# EAGLE design gs_box_board (EAGLE 9.6.2)
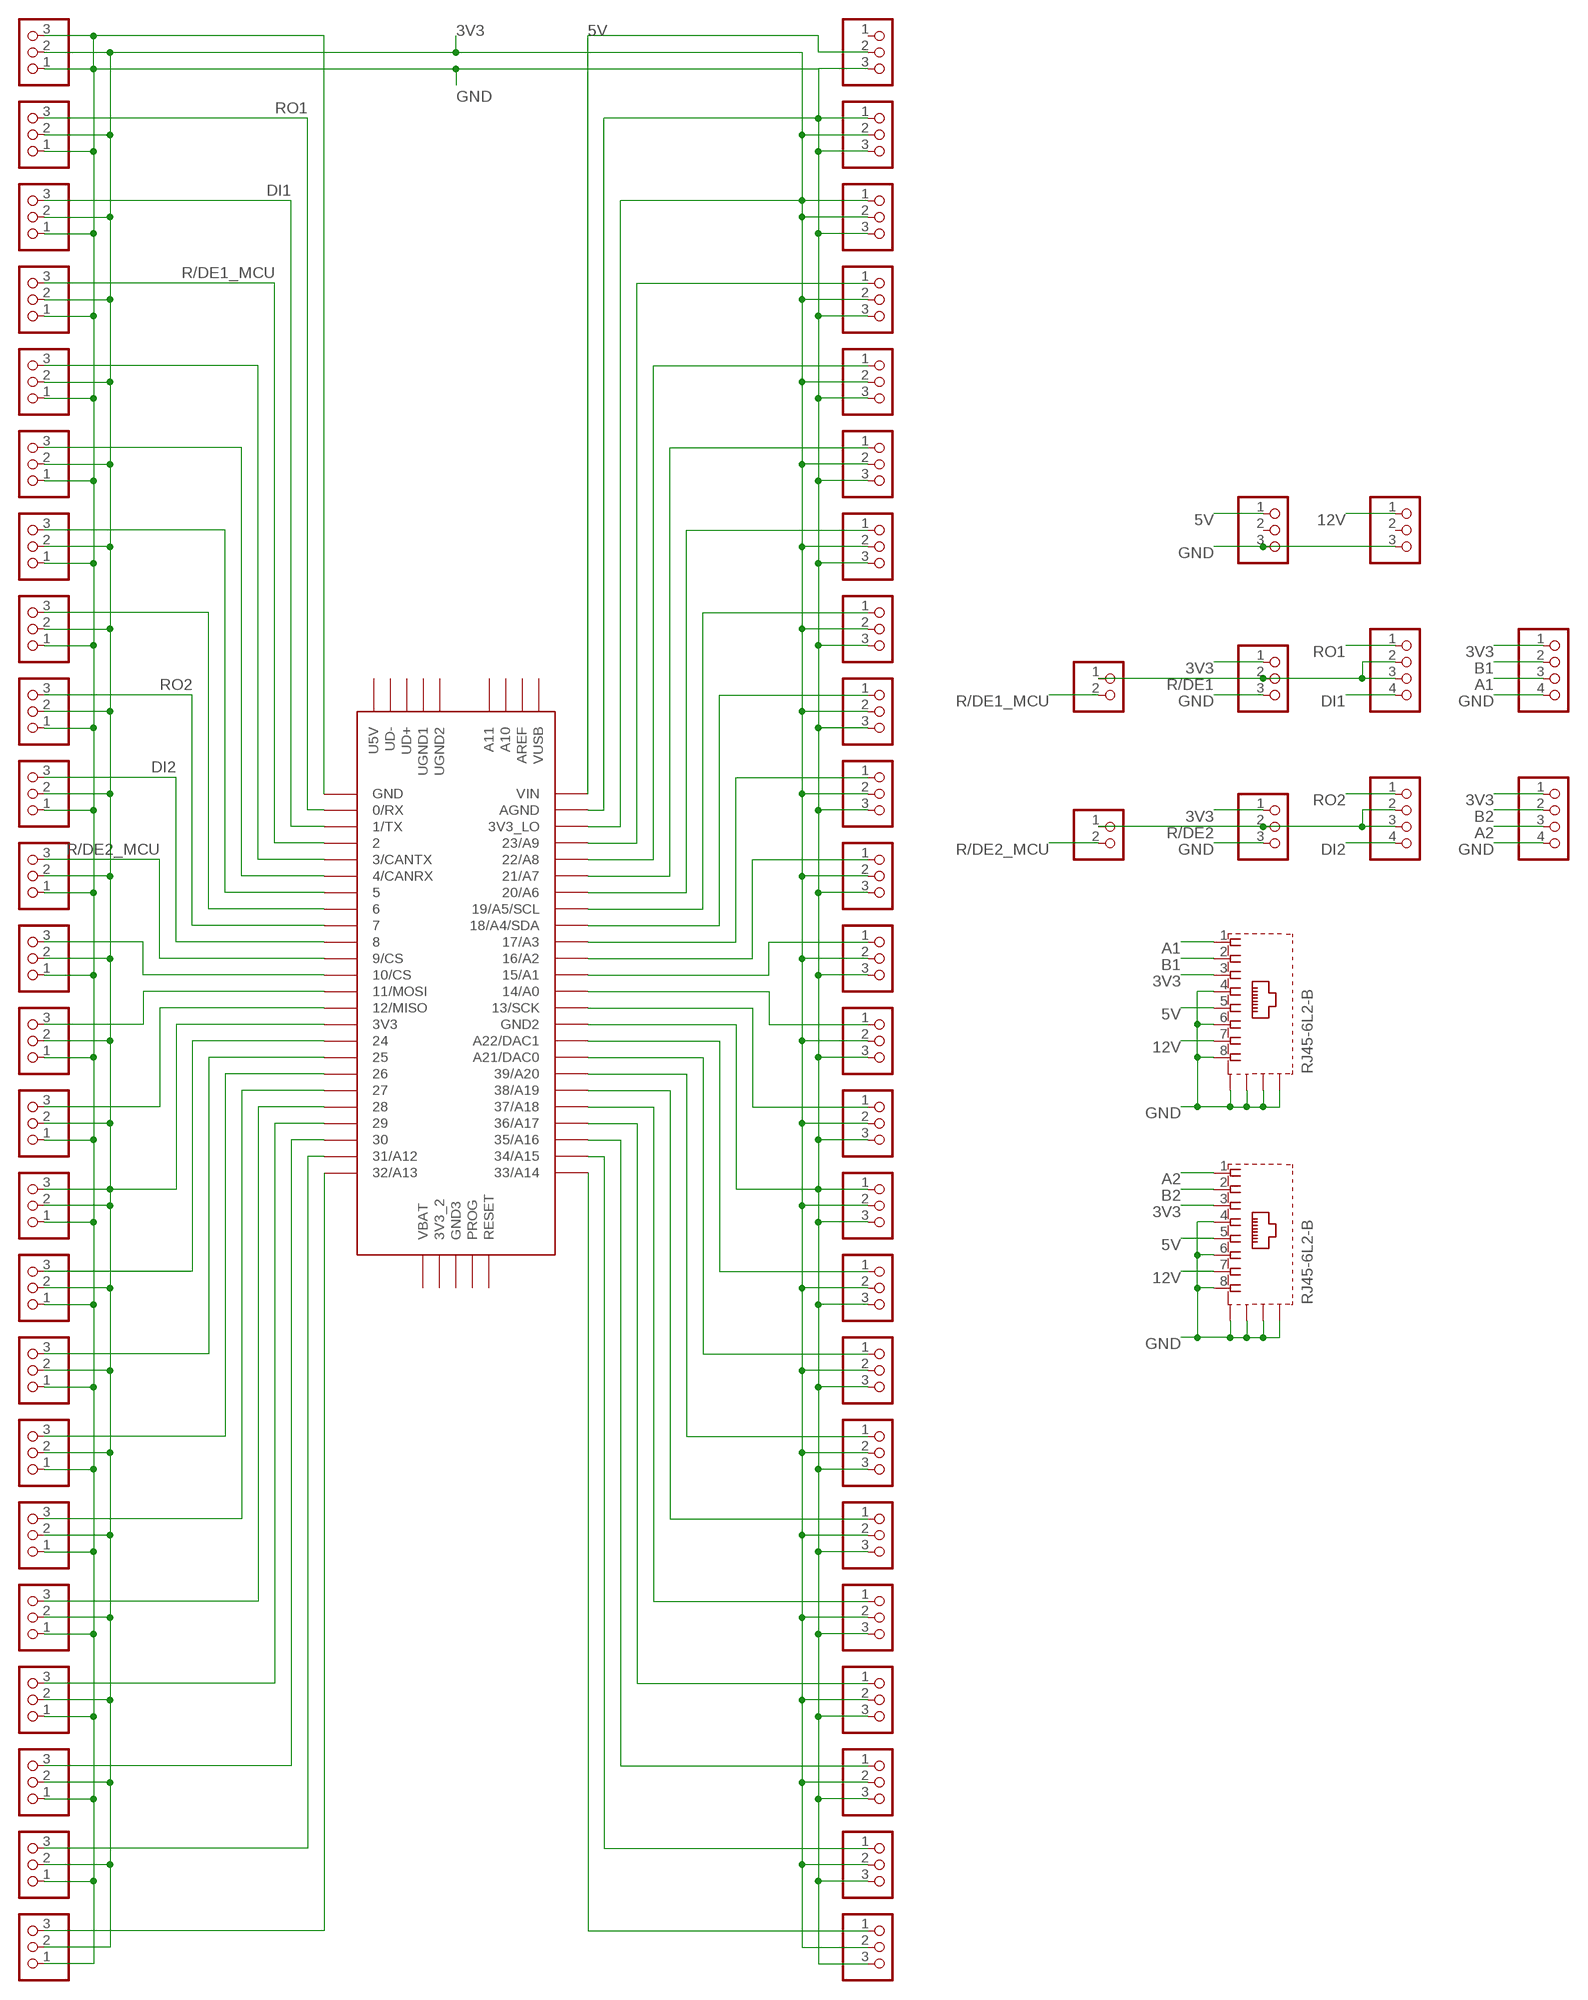
[diagram p0: schematic, sheet 1]

## Parts
JP1  PINHD-1X3  [1X03]
JP2  PINHD-1X3  [1X03]
JP3  PINHD-1X3  [1X03]
JP4  PINHD-1X3  [1X03]
JP5  PINHD-1X3  [1X03]
JP6  PINHD-1X3  [1X03]
JP7  PINHD-1X3  [1X03]
JP8  PINHD-1X3  [1X03]
JP9  PINHD-1X3  [1X03]
JP10  PINHD-1X3  [1X03]
JP11  PINHD-1X3  [1X03]
JP12  PINHD-1X3  [1X03]
JP13  PINHD-1X3  [1X03]
JP14  PINHD-1X3  [1X03]
JP15  PINHD-1X3  [1X03]
JP16  PINHD-1X3  [1X03]
JP17  PINHD-1X3  [1X03]
JP18  PINHD-1X3  [1X03]
JP19  PINHD-1X3  [1X03]
JP20  PINHD-1X3  [1X03]
JP21  PINHD-1X3  [1X03]
JP22  PINHD-1X3  [1X03]
JP23  PINHD-1X3  [1X03]
JP24  PINHD-1X3  [1X03]
JP25  PINHD-1X3  [1X03]
JP26  PINHD-1X3  [1X03]
JP27  PINHD-1X3  [1X03]
JP28  PINHD-1X3  [1X03]
JP29  PINHD-1X3  [1X03]
JP30  PINHD-1X3  [1X03]
JP31  PINHD-1X3  [1X03]
JP32  PINHD-1X3  [1X03]
JP33  PINHD-1X3  [1X03]
JP34  PINHD-1X3  [1X03]
JP35  PINHD-1X3  [1X03]
JP36  PINHD-1X3  [1X03]
JP37  PINHD-1X3  [1X03]
JP38  PINHD-1X3  [1X03]
JP39  PINHD-1X3  [1X03]
JP40  PINHD-1X3  [1X03]
JP41  PINHD-1X3  [1X03]
JP42  PINHD-1X3  [1X03]
JP43  PINHD-1X3  [1X03]
JP44  PINHD-1X3  [1X03]
JP45  PINHD-1X3  [1X03]
JP46  PINHD-1X3  [1X03]
JP47  PINHD-1X3  [1X03]
JP48  PINHD-1X3  [1X03]
JP49  PINHD-1X4  [1X04]
JP50  PINHD-1X4  [1X04]
JP51  PINHD-1X4  [1X04]
JP52  PINHD-1X4  [1X04]
JP53  PINHD-1X3  [1X03]
JP54  PINHD-1X3  [1X03]
JP55  PINHD-1X3  [1X03]
JP56  PINHD-1X3  [1X03]
JP57  PINHD-1X2  [1X02]
JP58  PINHD-1X2  [1X02]
U$1  TEENSY_3.5/3.6  [TEENSY_3.5/3.6]
X1  RJ45-6L2-B  [RJ45-SHIELD2]
X2  RJ45-6L2-B  [RJ45-SHIELD2]

## Nets
3V3: JP1.2 JP2.2 JP3.2 JP4.2 JP5.2 JP6.2 JP6.3 JP7.2 JP8.2 JP9.2 JP10.2 JP11.2 JP12.2 JP13.2 JP14.2 JP15.2 JP16.2 JP17.2 JP18.2 JP19.2 JP20.2 JP22.2 JP23.1 JP23.2 JP24.2 JP25.2 JP26.2 JP27.2 JP28.2 JP29.2 JP30.2 JP31.2 JP32.2 JP33.2 JP34.2 JP35.2 JP36.2 JP37.2 JP38.2 JP39.2 JP40.2 JP41.2 JP42.2 JP43.2 JP44.2 JP45.2 JP46.2 JP47.2 JP48.2 JP50.1 JP52.1 JP53.1 JP54.1 U$1.3V3 U$1.3V3_LO X1.3 X2.3
5V: JP21.2 JP56.1 U$1.VIN X1.5 X2.5
12V: JP55.1 X1.7 X2.7
A1: JP50.3 X1.1
A2: JP52.3 X2.1
B1: JP50.2 X1.2
B2: JP52.2 X2.2
DI1: JP34.3 JP49.4 U$1.1/TX
DI2: JP41.3 JP51.4 U$1.8
GND: JP1.3 JP2.1 JP3.1 JP4.1 JP5.1 JP6.1 JP7.1 JP8.1 JP9.1 JP10.1 JP11.1 JP12.3 JP13.3 JP14.3 JP15.1 JP15.3 JP16.3 JP17.3 JP18.3 JP19.3 JP20.3 JP21.3 JP22.1 JP22.3 JP23.3 JP24.3 JP25.3 JP26.3 JP27.3 JP28.3 JP29.3 JP30.3 JP31.3 JP32.1 JP32.3 JP33.1 JP34.1 JP35.1 JP36.1 JP37.1 JP38.1 JP39.1 JP40.1 JP41.1 JP42.1 JP43.1 JP44.1 JP45.1 JP46.3 JP47.3 JP48.3 JP50.4 JP52.4 JP53.3 JP54.3 JP55.3 JP56.3 U$1.AGND U$1.GND U$1.GND2 X1.4 X1.6 X1.8 X1.S1(S) X1.S2(S) X1.S3(S) X1.S4(S) X2.4 X2.6 X2.8 X2.S1(S) X2.S2(S) X2.S3(S) X2.S4(S)
N$7: JP36.3 U$1.3/CANTX
N$8: JP37.3 U$1.4/CANRX
N$9: JP38.3 U$1.5
N$10: JP39.3 U$1.6
N$12: JP3.3 U$1.10/CS
N$13: JP4.3 U$1.11/MOSI
N$14: JP5.3 U$1.12/MISO
N$16: JP7.3 U$1.24
N$17: JP8.3 U$1.25
N$18: JP9.3 U$1.26
N$19: JP10.3 U$1.27
N$20: JP11.3 U$1.28
N$21: JP42.3 U$1.29
N$22: JP43.3 U$1.30
N$23: JP44.3 U$1.31/A12
N$24: JP45.3 U$1.32/A13
N$28: JP24.1 U$1.23/A9
N$29: JP25.1 U$1.22/A8
N$30: JP26.1 U$1.21/A7
N$31: JP27.1 U$1.20/A6
N$32: JP28.1 U$1.19/A5/SCL
N$33: JP29.1 U$1.18/A4/SDA
N$34: JP30.1 U$1.17/A3
N$35: JP1.1 U$1.16/A2
N$36: JP12.1 U$1.15/A1
N$37: JP13.1 U$1.14/A0
N$38: JP14.1 U$1.13/SCK
N$40: JP16.1 U$1.A22/DAC1
N$41: JP17.1 U$1.21/DAC0(A21/DAC0)
N$42: JP18.1 U$1.39/A20
N$43: JP19.1 U$1.38/A19
N$44: JP20.1 U$1.37/A18
N$45: JP31.1 U$1.36/A17
N$46: JP46.1 U$1.35/A16
N$47: JP47.1 U$1.34/A15
N$48: JP48.1 U$1.33/A14
R/DE1: JP49.2 JP49.3 JP53.2 JP58.1
R/DE1_MCU: JP35.3 JP58.2 U$1.2
R/DE2: JP51.2 JP51.3 JP54.2 JP57.1
R/DE2_MCU: JP2.3 JP57.2 U$1.9/CS
RO1: JP33.3 JP49.1 U$1.0/RX
RO2: JP40.3 JP51.1 U$1.7
Unconnected: JP21.1 JP55.2 JP56.2 U$1.3V3_2 U$1.A10 U$1.A11 U$1.AREF U$1.GND3 U$1.PROG U$1.RESET U$1.U5V U$1.UD+ U$1.UD- U$1.UGND1 U$1.UGND2 U$1.VBAT U$1.VUSB

## Library data of the parts
JP1-JP48 JP53-JP56 = adafruit:PINHD-1X3: PIN HEADER
JP49-JP52 = pinhead:PINHD-1X4: PIN HEADER
JP57 JP58 = pinhead:PINHD-1X2: PIN HEADER
U$1 = Teensy356:TEENSY_3.5/3.6
X1 X2 = con-tycoelectronics:RJ45*2: RJ45 Low Profile Shield Type 2 For all RJ45 L, LC, LCT and X Series Models Source: www.tycoelectronics.com .. ENG_DS_1654001_1099_RJ_L_0507.pdf; MPN: RJ45-6L2-B; OC_FARNELL: unknown; OC_NEWARK: 16R6096

## Board
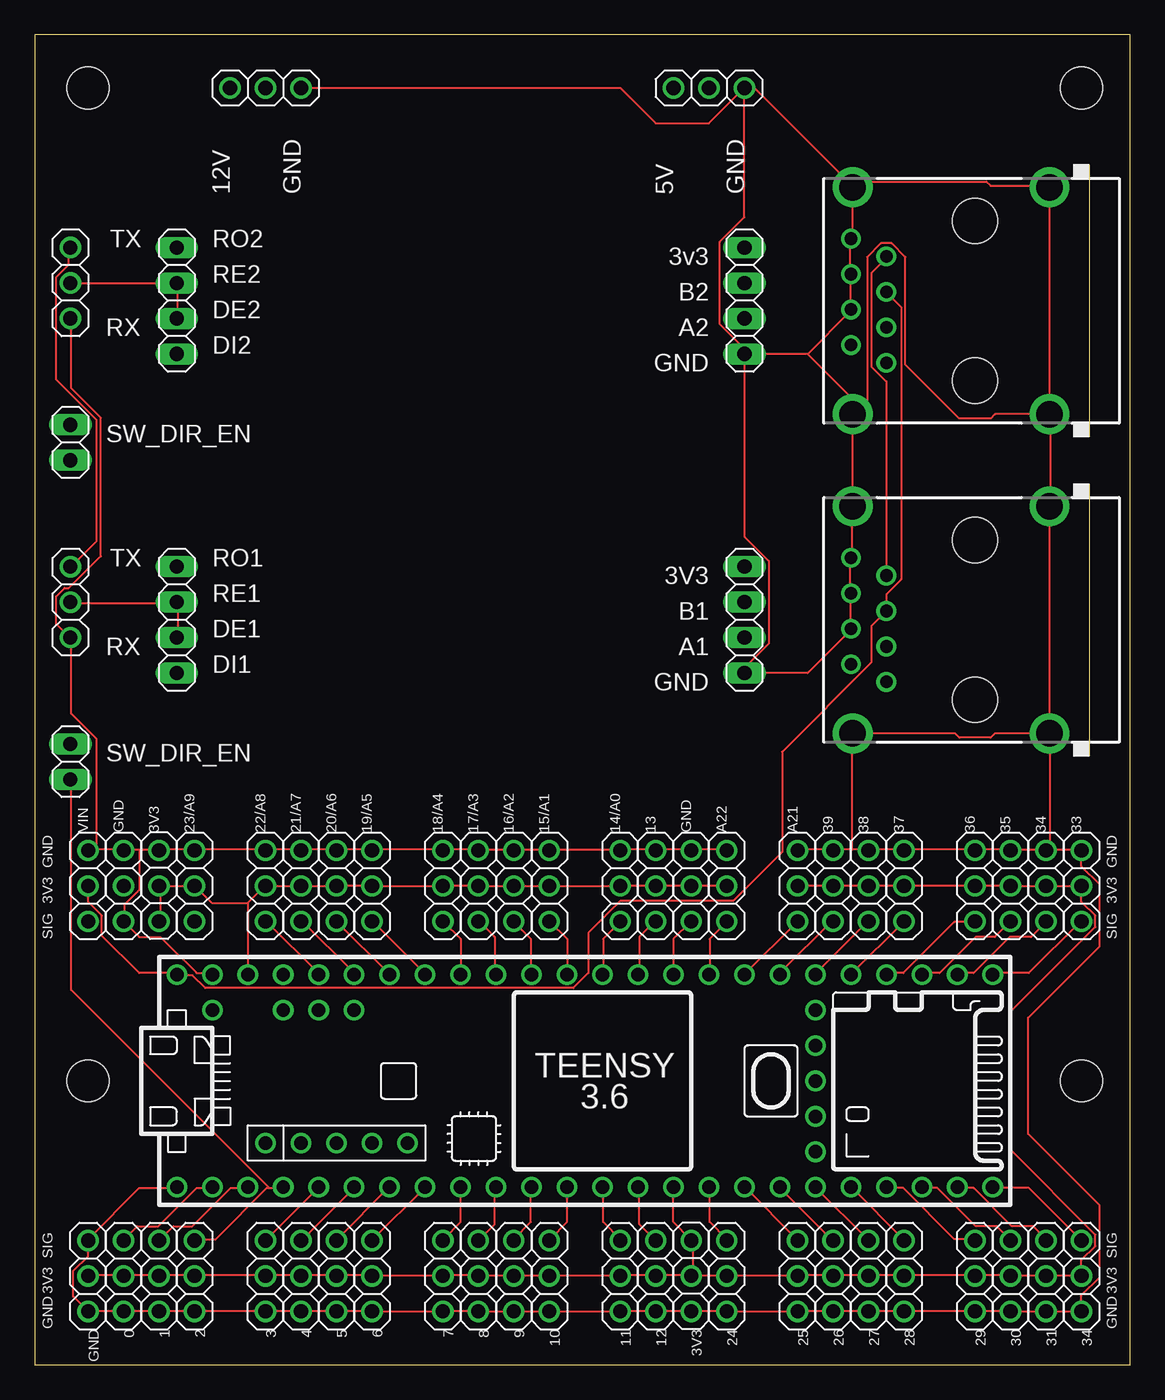
[diagram p1: board, top side]
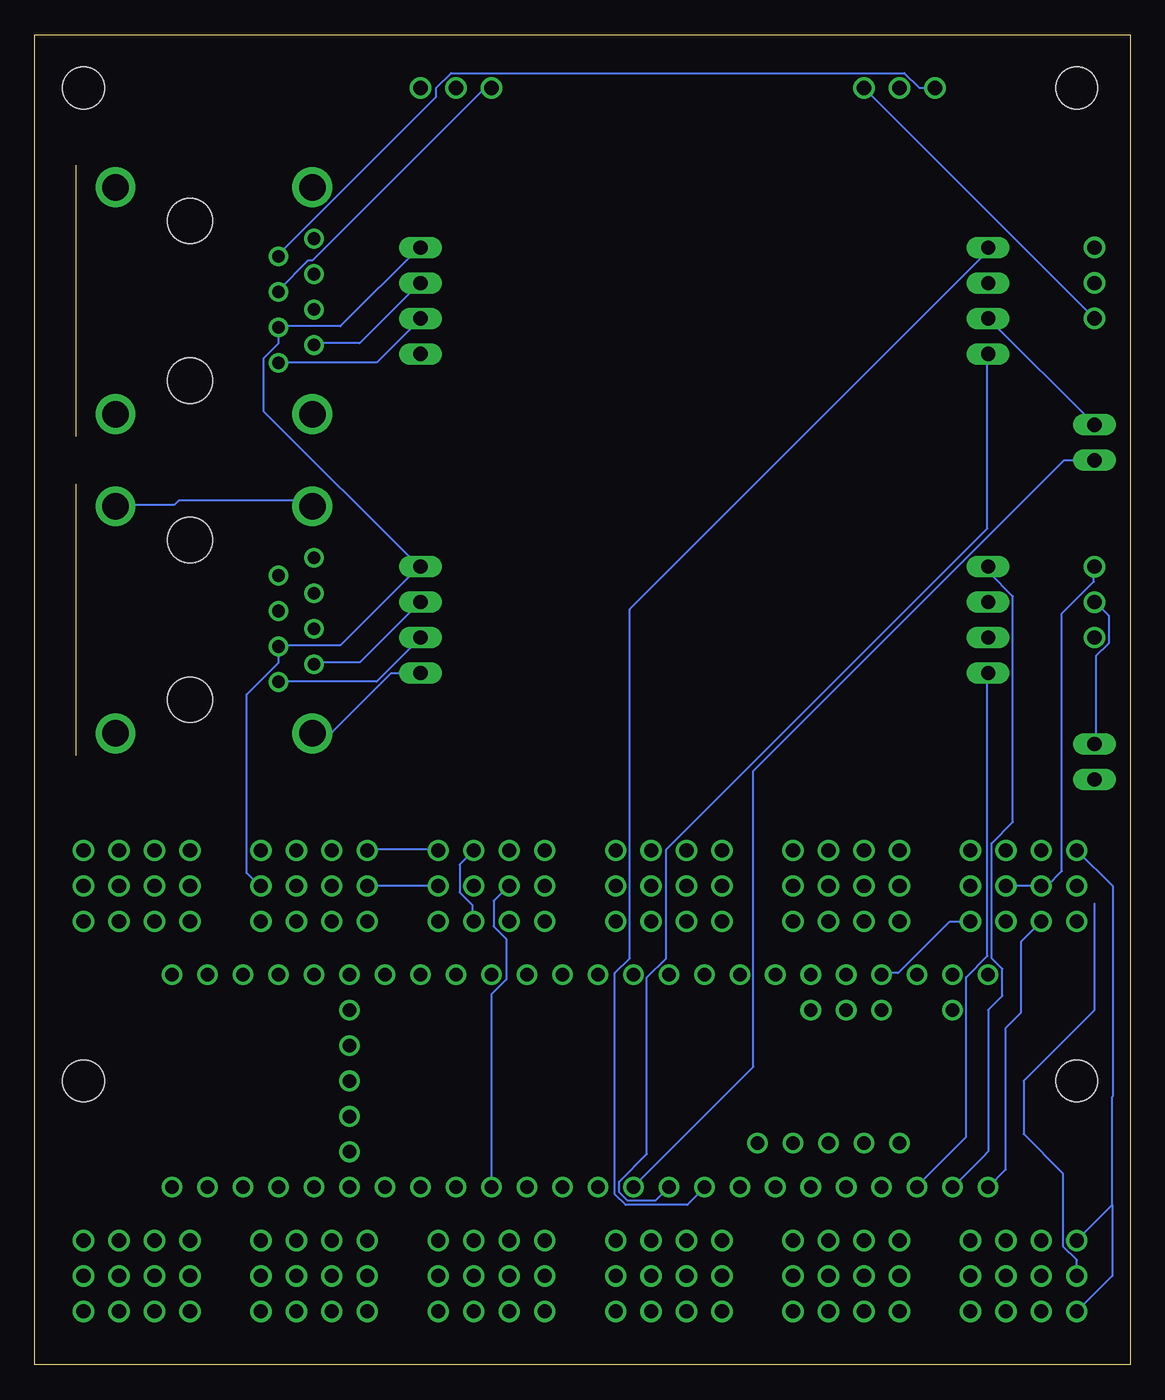
[diagram p2: board, bottom side, seen from below]

Size 78.41 x 95.24 mm. Coordinates in mm from the lower left corner, seen from the top.
Outline: 0,0 78.41,0 78.41,95.24 0,95.24 0,0
Copper layers (1*16): Top 0.035mm / dielectric 1.5mm / Bottom 0.035mm
Design rules "default": minimum track width 6mil, minimum drill 0.35mm, track to track 6mil, track to pad 6mil, pad to pad 6mil, via to via 6mil, smd to smd 6mil, copper to edge 40mil, drill to drill 6mil, minimum pad ring 10mil, minimum via ring 8mil, stop-mask expansion 4mil, vias tented up to drill 0mil, thermal gap 10mil
Holes 3 mm at 3.81,20.32 74.93,20.32 3.81,91.44 74.93,91.44

### Footprints (pad centres in the part's own frame; a part is rotated, then mirrored left to right if it is on the bottom)
1X03 = drill 1.016: 1 -2.54,0; 2 0,0; 3 2.54,0
1X04 = drill 1.016 long: 1 -3.81,0; 2 -1.27,0; 3 1.27,0; 4 3.81,0
1X02 = drill 1.016 long: 1 -1.27,0; 2 1.27,0
TEENSY_3.5/3.6 = drill 0.965: 0/RX -25.4,-7.62; 1/TX -22.86,-7.62; 2 -20.32,-7.62; 3/CANTX -17.78,-7.62; 3V3 7.62,-7.62; 3V3_2 17.78,-2.54; 3V3_LO -22.86,7.62; 4/CANRX -15.24,-7.62; 5 -12.7,-7.62; 6 -10.16,-7.62; 7 -7.62,-7.62; 8 -5.08,-7.62; 9/CS -2.54,-7.62; 10/CS 0,-7.62; 11/MOSI 2.54,-7.62; 12/MISO 5.08,-7.62; 13/SCK 5.08,7.62; 14/A0 2.54,7.62; 15/A1 0,7.62; 16/A2 -2.54,7.62; 17/A3 -5.08,7.62; 18/A4/SDA -7.62,7.62; 19/A5/SCL -10.16,7.62; 20/A6 -12.7,7.62; 21/A7 -15.24,7.62; 21/DAC0 12.7,7.62; 22/A8 -17.78,7.62; 23/A9 -20.32,7.62; 24 10.16,-7.62; 25 12.7,-7.62; 26 15.24,-7.62; 27 17.78,-7.62; 28 20.32,-7.62; 29 22.86,-7.62; 30 25.4,-7.62; 31/A12 27.94,-7.62; 32/A13 30.48,-7.62; 33/A14 30.48,7.62; 34/A15 27.94,7.62; 35/A16 25.4,7.62; 36/A17 22.86,7.62; 37/A18 20.32,7.62; 38/A19 17.78,7.62; 39/A20 15.24,7.62; A10 -17.78,5.08; A11 -15.24,5.08; A22/DAC1 10.16,7.62; AGND -25.4,7.62; AREF -20.32,5.08; GND -27.94,-7.62; GND2 7.62,7.62; GND3 17.78,0; PROG 17.78,2.54; RESET 17.78,5.08; U5V -21.59,-4.445; UD+ -16.51,-4.445; UD- -19.05,-4.445; UGND1 -13.97,-4.445; UGND2 -11.43,-4.445; VBAT 17.78,-5.08; VIN -27.94,7.62; VUSB -25.4,5.08
RJ45-SHIELD2 = drill 0.9 pad 1.4: 1 -4.445,6.35; 2 -3.175,8.89; 3 -1.905,6.35; 4 -0.635,8.89; 5 0.635,6.35; 6 1.905,8.89; 7 3.175,6.35; 8 4.445,8.89 | drill 1.9 pad 2.5: S1 -8.128,-5.33; S2 8.128,-5.33; S3 -8.128,8.76; S4 8.128,8.76 | hole 3.251: -5.715,0; 5.715,0

### Placement (x,y rotation side)
JP1  34.29,34.29 90 top
JP2  34.29,6.35 90 top
JP3  36.83,6.35 90 top
JP4  41.91,6.35 90 top
JP5  44.45,6.35 90 top
JP6  8.89,34.29 270 top
JP7  49.53,6.35 90 top
JP8  54.61,6.35 90 top
JP9  57.15,6.35 90 top
JP10  59.69,6.35 90 top
JP11  62.23,6.35 90 top
JP12  36.83,34.29 90 top
JP13  41.91,34.29 90 top
JP14  44.45,34.29 90 top
JP15  6.35,34.29 90 top
JP16  49.53,34.29 90 top
JP17  54.61,34.29 90 top
JP18  57.15,34.29 90 top
JP19  59.69,34.29 90 top
JP20  62.23,34.29 90 top
JP21  3.81,34.29 90 top
JP22  46.99,34.29 90 top
JP23  46.99,6.35 270 top
JP24  11.43,34.29 90 top
JP25  16.51,34.29 90 top
JP26  19.05,34.29 90 top
JP27  21.59,34.29 90 top
JP28  24.13,34.29 90 top
JP29  29.21,34.29 90 top
JP30  31.75,34.29 90 top
JP31  67.31,34.29 90 top
JP32  3.81,6.35 90 top
JP33  6.35,6.35 90 top
JP34  8.89,6.35 90 top
JP35  11.43,6.35 90 top
JP36  16.51,6.35 90 top
JP37  19.05,6.35 90 top
JP38  21.59,6.35 90 top
JP39  24.13,6.35 90 top
JP40  29.21,6.35 90 top
JP41  31.75,6.35 90 top
JP42  67.31,6.35 90 top
JP43  69.85,6.35 90 top
JP44  72.39,6.35 90 top
JP45  74.93,6.35 90 top
JP46  69.85,34.29 90 top
JP47  72.39,34.29 90 top
JP48  74.93,34.29 90 top
JP49  10.16,53.34 270 top
JP50  50.8,76.2 270 top
JP51  10.16,76.2 270 top
JP52  50.8,53.34 270 top
JP53  2.54,54.61 270 top
JP54  2.54,77.47 270 top
JP55  16.51,91.44 0 top
JP56  48.26,91.44 0 top
JP57  2.54,66.04 270 top
JP58  2.54,43.18 270 top
U$1  38.1,20.32 0 top
X1  67.31,76.2 90 top
X2  67.31,53.34 90 top

### Tracks (layer width: path | path; a pad name or v marks a point on that pad's centre or on a via)
3V3
  Top 0.152: 57.15,6.4 54.71,6.4 JP8.2 54.56,6.4 49.53,6.4 | 57.15,6.4 59.59,6.4 JP10.2 59.74,6.4 62.18,6.4 JP11.2 62.33,6.4 67.21,6.4 JP42.2 67.36,6.4 69.8,6.4 JP43.2 69.95,6.4 72.39,6.4 | 57.15,6.4 JP9.2 | 72.39,6.4 74.83,6.4 JP45.2 74.93,7.49 75.92,8.48 75.92,9.31 69.8,15.44 69.8,25.22 75.92,31.34 75.92,32.16 74.93,33.15 JP48.2 JP47.2 JP46.2 JP31.2 JP20.2 JP19.2 JP18.2 JP17.2 | 72.39,6.4 JP44.2 | 41.91,6.4 44.35,6.4 JP5.2 44.5,6.4 46.94,6.4 JP23.2 47.09,6.4 | U$1.3V3 45.72,10.21 46.94,8.99 JP23.1 47.09,8.84 47.09,6.4 | 47.09,6.4 49.53,6.4 | 34.29,6.4 31.85,6.4 JP41.2 31.7,6.4 29.26,6.4 JP40.2 29.11,6.4 24.23,6.4 JP39.2 24.08,6.4 21.64,6.4 JP38.2 21.49,6.4 19.05,6.4 | 34.29,6.4 36.73,6.4 JP3.2 36.88,6.4 41.91,6.4 | 34.29,6.4 JP2.2 | JP32.2 3.81,6.4 6.25,6.4 JP33.2 6.4,6.4 8.84,6.4 JP34.2 8.99,6.4 11.43,6.4 | 19.05,6.4 16.61,6.4 JP36.2 16.46,6.4 11.43,6.4 | 19.05,6.4 JP37.2 | 11.43,6.4 JP35.2 | 41.91,6.4 JP4.2 | 49.53,6.4 JP7.2 | JP16.2 JP22.2 JP14.2 JP13.2 JP12.2 JP1.2 JP30.2 JP29.2 JP28.2 JP27.2 JP26.2 JP25.2 16.46,34.29 15.24,33.07 | 15.24,33.07 U$1.3V3_LO | 8.99,34.29 8.99,31.85 JP6.3 | 8.99,34.29 JP24.2 12.65,33.07 15.24,33.07 | 8.99,34.29 JP6.2 | JP54.1 2.44,80.01 2.44,78.79 1.52,77.88 1.52,70.56 4.42,67.67 4.42,58.98 2.59,57.15 JP53.1
  Bottom 0.152: JP50.1 50.9,80.01 56.54,74.37 60.96,74.37 X1.3 60.96,73.15 62.03,72.08 62.03,68.28 50.9,57.15 | 50.9,57.15 56.54,51.51 60.96,51.51 X2.3 60.96,50.29 63.25,48.01 63.25,35.2 62.33,34.29 JP20.2 | 50.9,57.15 JP52.1 | JP53.1 2.59,57.15 2.59,56.08 4.88,53.8 4.88,35.36 5.94,34.29 JP15.2 JP6.2 | JP16.2 JP17.2 | U$1.3V3 45.72,26.52 44.65,27.58 44.65,30.48 45.57,31.39 45.57,33.22 44.5,34.29 JP14.2 | JP32.2 3.81,7.49 4.8,8.48 4.8,13.69 7.62,16.51 7.62,20.32 2.54,25.4 2.54,33.02
5V
  Top 0.152: X1.5 60.96,76.81 62.03,75.74 62.03,56.24 60.96,55.17 X2.5 60.96,53.95 59.89,52.88 59.89,50.29 53.49,43.89 53.49,36.73 49.99,33.22 41.91,33.22 39.62,30.94 39.62,28.04 38.56,26.98 12.19,26.98 11.28,27.89 10.21,27.89 U$1.VIN 10.06,28.04 7.47,28.04 4.8,30.71 4.8,32.16 3.81,33.15 JP21.2
  Bottom 0.152: JP56.1 46.18,91.44 58.52,79.1 58.83,79.1 60.96,76.96 X1.5
12V
  Top 0.152: X2.7 60.96,70.41 59.89,71.48 59.89,78.18 60.96,79.25 X1.7
  Bottom 0.152: JP55.1 15.09,91.44 16.15,92.51 48.62,92.51 49.68,91.44 49.68,90.83 60.96,79.55 X1.7
A1
  Bottom 0.152: JP50.3 53.95,71.78 60.96,71.78 X1.1
A2
  Bottom 0.152: JP52.3 53.95,48.92 60.96,48.92 X2.1
B1
  Bottom 0.152: X1.2 58.37,73.15 55.17,73.15 50.9,77.42 JP50.2
B2
  Bottom 0.152: X2.2 58.37,50.29 55.17,50.29 50.9,54.56 JP52.2
DI1
  Top 0.152: JP34.3 9.91,9.91 11.28,9.91 14.02,12.65 15.24,12.65 U$1.1/TX
  Bottom 0.152: JP49.4 10.21,49.53 10.21,29.26 11.73,27.74 11.73,16.31 15.24,12.8 U$1.1/TX
DI2
  Top 0.152: JP41.3 32.92,10.06 32.92,12.65 U$1.8
  Bottom 0.152: U$1.8 33.98,11.73 35.97,11.73 36.58,12.34 36.58,13.11 34.59,15.09 34.59,27.74 33.22,29.11 33.22,36.88 10.21,59.89 10.21,72.39 JP51.4
GND
  Top 0.152: U$1.GND 10.06,12.65 7.47,12.65 3.81,8.99 JP32.3 3.81,7.77 2.74,6.71 2.74,4.88 JP32.1 JP33.1 JP34.1 JP35.1 JP36.1 JP37.1 JP38.1 JP39.1 JP40.1 JP41.1 JP2.1 JP3.1 JP4.1 JP5.1 JP23.3 JP7.1 JP8.1 JP9.1 JP10.1 JP11.1 JP42.1 JP43.1 JP44.1 JP45.1 74.93,4.95 76.22,6.24 76.22,11.4 71.12,16.51 71.12,24.84 76.22,29.94 76.22,34.4 74.93,35.69 JP48.3 74.83,36.88 72.69,36.88 | U$1.AGND 12.65,28.04 11.58,28.04 8.99,30.63 7.47,30.63 JP15.1 6.4,31.85 6.4,32.92 7.47,33.98 7.47,36.88 | 11.43,36.88 8.99,36.88 JP6.1 8.84,36.88 7.47,36.88 | 4.42,36.88 6.25,36.88 JP15.3 6.4,36.88 7.47,36.88 | 4.42,36.88 3.81,36.88 JP21.3 4.42,36.88 | 4.42,36.88 4.42,44.81 2.59,46.63 2.59,51.97 JP53.3 2.44,52.12 1.52,53.03 1.52,55.02 2.13,55.63 2.44,55.63 4.72,57.91 4.72,67.82 2.59,69.95 2.59,74.83 JP54.3 | 72.69,67.31 72.69,67.97 X1.S1 68.74,68.07 68.44,67.77 66.18,67.77 62.33,71.62 62.33,79.32 61.35,80.31 60.57,80.31 59.59,79.32 59.59,69.04 58.52,67.97 | 72.69,67.31 72.69,61.57 X2.S2 X2.S1 | 55.32,72.39 JP50.4 | 55.32,72.39 58.37,75.44 X1.4 58.37,75.59 58.37,78.03 X1.6 58.37,78.18 58.37,80.62 X1.8 58.52,80.77 58.52,84.28 X1.S4 | 55.32,72.39 58.52,69.19 58.52,68.12 X1.S3 58.52,67.97 | JP56.3 51.51,91.44 58.52,84.43 X1.S4 | X1.S4 58.67,84.43 58.98,84.73 68.12,84.73 68.43,84.43 72.54,84.43 X1.S2 72.64,67.36 72.69,67.31 | 58.52,67.97 58.52,61.57 X2.S4 58.52,61.42 58.52,57.91 X2.8 58.37,57.76 58.37,55.32 X2.6 58.37,55.17 58.37,52.73 X2.4 58.37,52.58 55.32,49.53 JP52.4 50.8,49.91 52.55,51.66 52.55,57.56 50.8,59.31 JP50.4 | 57.15,36.88 54.71,36.88 JP17.3 | 58.52,36.88 59.59,36.88 JP19.3 59.74,36.88 62.18,36.88 JP20.3 62.33,36.88 67.21,36.88 JP31.3 67.36,36.88 69.8,36.88 JP46.3 69.95,36.88 72.39,36.88
  Top 0.152: 58.52,36.88 57.15,36.88 | 57.15,36.88 JP18.3 | 72.39,36.88 72.69,36.88 | 72.39,36.88 JP47.3 72.69,36.88 | 58.52,36.88 58.52,45.11 X2.S3 65.88,45.21 66.18,44.91 68.44,44.91 68.74,45.21 X2.S1 | 72.69,36.88 72.69,45.11 X2.S1 | U$1.GND2 45.72,30.48 JP22.1 | 41.91,36.88 44.35,36.88 JP14.3 44.5,36.88 46.94,36.88 JP22.3 47.09,36.88 49.53,36.88 JP16.3 | 19.05,36.88 16.61,36.88 JP25.3 16.46,36.88 11.43,36.88 | 19.05,36.88 21.49,36.88 JP27.3 21.64,36.88 24.08,36.88 JP28.3 24.23,36.88 29.11,36.88 JP29.3 29.26,36.88 31.7,36.88 JP30.3 31.85,36.88 34.29,36.88 | 19.05,36.88 JP26.3 | 34.29,36.88 36.73,36.88 JP12.3 36.88,36.88 41.91,36.88 | 34.29,36.88 JP1.3 | 41.91,36.88 JP13.3 | 11.43,36.88 JP24.3 | JP55.3 41.91,91.44 44.45,88.9 48.26,88.9 JP56.3 | JP50.4 50.8,72.77 49.05,74.52 49.05,80.42 50.8,82.17 JP56.3
  Bottom 0.152: JP55.3 JP54.3 | X2.S2 72.54,61.57 68.43,61.57 68.12,61.87 58.98,61.87 58.67,61.57 X2.S4 | JP22.3 48.01,35.81 48.01,33.83 47.09,32.92 47.09,31.85 JP22.1 | JP17.3 54.56,36.88 49.53,36.88 JP16.3 | JP52.4 52.88,49.53 57.15,45.26 58.52,45.26 X2.S3 | JP15.1 7.82,30.28 7.82,25.2 8.89,24.13 8.89,13.97 U$1.GND 10.06,12.8 | JP32.3 1.27,11.43 | JP21.3 1.22,34.24 1.22,19.25 1.27,19.19 1.27,11.43 | 1.27,11.43 1.27,6.35 JP32.1
N$7
  Top 0.152: JP36.3 U$1.3/CANTX
N$8
  Top 0.152: U$1.4/CANRX 22.86,12.65 19.05,8.84 JP37.3
N$9
  Top 0.152: U$1.5 25.3,12.65 21.64,8.99 JP38.3
N$10
  Top 0.152: JP39.3 U$1.6
N$12
  Top 0.152: U$1.10/CS 38.1,10.21 36.88,8.99 JP3.3
N$13
  Top 0.152: U$1.11/MOSI 40.69,12.65 40.69,10.21 41.91,8.99 JP4.3
N$14
  Top 0.152: JP5.3 43.28,10.06 43.28,12.65 U$1.12/MISO
N$16
  Top 0.152: U$1.24 48.31,12.65 48.31,10.21 49.53,8.99 JP7.3
N$17
  Top 0.152: U$1.25 50.9,12.65 54.56,8.99 JP8.3
N$18
  Top 0.152: U$1.26 53.34,12.65 57.15,8.84 JP9.3
N$19
  Top 0.152: JP10.3 U$1.27
N$20
  Top 0.152: U$1.28 58.52,12.65 62.18,8.99 JP11.3
N$21
  Top 0.152: U$1.29 60.96,12.65 62.18,12.65 65.84,8.99 67.21,8.99 JP42.3
N$22
  Top 0.152: U$1.30 63.55,12.65 64.62,12.65 67.36,9.91 68.89,9.91 69.8,8.99 JP43.3
N$23
  Top 0.152: U$1.31/A12 66.14,12.65 67.21,12.65 69.95,9.91 71.48,9.91 72.39,8.99 JP44.3
N$24
  Top 0.152: JP45.3 71.17,12.65 68.58,12.65 U$1.32/A13
N$28
  Bottom 0.152: U$1.23/A9 17.68,28.04 16.61,28.04 12.95,31.7 11.43,31.7 JP24.1
N$29
  Top 0.152: U$1.22/A8 20.27,28.04 16.61,31.7 JP25.1
N$30
  Top 0.152: U$1.21/A7 22.86,28.04 19.05,31.85 JP26.1
N$31
  Top 0.152: JP27.1 U$1.20/A6
N$32
  Top 0.152: U$1.19/A5/SCL 27.89,28.04 24.23,31.7 JP28.1
N$33
  Top 0.152: U$1.18/A4/SDA 30.48,30.48 JP29.1
N$34
  Top 0.152: U$1.17/A3 32.92,28.04 32.92,30.63 31.85,31.7 JP30.1
N$35
  Top 0.152: U$1.16/A2 35.51,28.04 35.51,30.48 34.29,31.7 JP1.1
N$36
  Top 0.152: U$1.15/A1 38.1,30.48 JP12.1
N$37
  Top 0.152: U$1.14/A0 40.69,28.04 40.69,30.48 41.91,31.7 JP13.1
N$38
  Top 0.152: U$1.13/SCK 43.28,28.04 43.28,30.63 44.35,31.7 JP14.1
N$40
  Top 0.152: U$1.A22/DAC1 48.31,28.04 48.31,30.48 49.53,31.7 JP16.1
N$41
  Top 0.152: JP17.1 U$1.21/DAC0
N$42
  Top 0.152: U$1.39/A20 53.34,28.04 57.15,31.85 JP18.1
N$43
  Top 0.152: U$1.38/A19 55.93,28.04 59.59,31.7 JP19.1
N$44
  Top 0.152: JP20.1 U$1.37/A18
N$45
  Top 0.152: U$1.36/A17 60.96,28.04 62.18,28.04 65.84,31.7 67.21,31.7 JP31.1
N$46
  Top 0.152: JP46.1 68.73,30.63 67.36,30.63 64.77,28.04 63.55,28.04 U$1.35/A16
N$47
  Top 0.152: U$1.34/A15 66.14,28.04 67.21,28.04 69.8,30.63 71.32,30.63 72.39,31.7 JP47.1
N$48
  Top 0.152: U$1.33/A14 68.58,28.04 71.17,28.04 74.83,31.7 JP48.1
R/DE1
  Top 0.152: JP49.3 10.21,52.12 10.21,54.56 JP49.2 10.06,54.56 2.59,54.56 JP53.2
  Bottom 0.152: JP58.1 2.44,44.5 2.44,50.75 1.52,51.66 1.52,53.65 2.44,54.56 JP53.2
R/DE1_MCU
  Top 0.152: 16.76,12.65 16.61,12.65 12.95,8.99 11.43,8.99 JP35.3 | 16.76,12.65 17.68,12.65 U$1.2 | 16.76,12.65 2.59,26.82 2.59,41.91 JP58.2
R/DE2
  Top 0.152: JP54.2 2.59,77.42 10.06,77.42 JP51.2 10.21,77.42 10.21,74.98 JP51.3
  Bottom 0.152: JP51.3 JP57.1
R/DE2_MCU
  Top 0.152: U$1.9/CS 35.51,12.65 35.51,10.21 34.29,8.99 JP2.3
  Bottom 0.152: JP57.2 4.72,64.77 26.98,42.52 26.98,21.34 35.51,12.8 U$1.9/CS
RO1
  Top 0.152: U$1.0/RX 12.65,12.65 11.58,12.65 8.84,9.91 7.32,9.91 6.4,8.99 JP33.3
  Bottom 0.152: JP49.1 10.06,57.15 10.06,56.69 8.38,55.02 8.38,38.86 9.91,37.34 9.91,29.11 9.14,28.35 9.14,26.42 10.16,25.4 10.16,15.27 10.36,15.06 10.36,15.04 U$1.0/RX 12.65,12.8
RO2
  Top 0.152: U$1.7 30.48,10.21 29.26,8.99 JP40.3
  Bottom 0.152: JP51.1 10.21,80.01 10.21,79.7 35.81,54.1 35.81,29.11 36.88,28.04 36.88,12.19 36.12,11.43 31.7,11.43 30.48,12.65 U$1.7

### Text on the board
tNames: 12V | GND | 5V | GND | TX | RO2 | 3v3 | RE2 | B2 | DE2 | A2 | RX | DI2 | GND | SW_DIR_EN | TX | RO1 | 3V3 | RE1 | B1 | DE1 | A1 | RX | DI1 | GND | SW_DIR_EN | VIN | GND | 3V3 | 23/A9 | 22/A8 | 21/A7 | 20/A6 | 19/A5 | 18/A4 | 17/A3 | 16/A2 | 15/A1 | 14/A0 | 13 | GND | A22 | A21 | 39 | 38 | 37 | 36 | 35 | 34 | 33 | GND | GND | 3V3 | 3V3 | SIG | SIG | SIG | SIG | 3V3 | 3V3 | GND | GND | 0 | 1 | 2 | 3 | 4 | 5 | 6 | 7 | 8 | 9 | 10 | 11 | 12 | 3V3 | 24 | 25 | 26 | 27 | 28 | 29 | 30 | 31 | 34 | GND